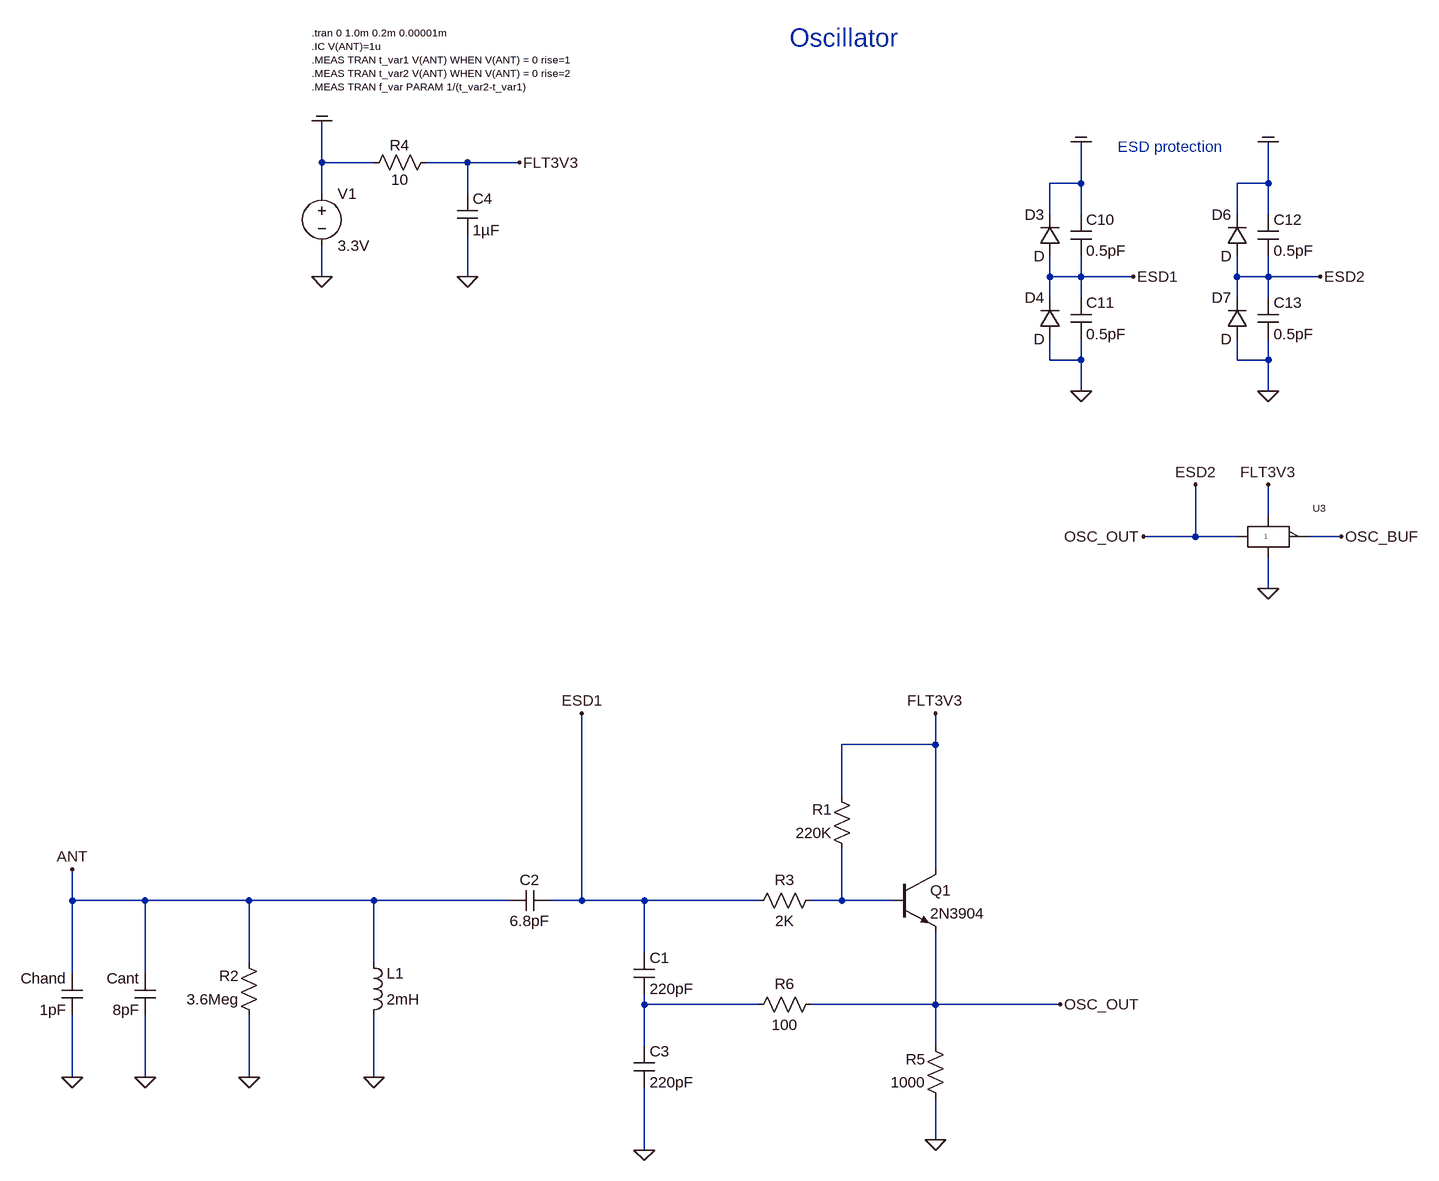
[diagram p0: schematic 2020_npn_osc_v1.asc]
2020_npn_osc_v1.asc, the LTspice schematic file:
Version 4
SHEET 1 2908 1588
WIRE -1056 -336 -1056 -400
WIRE -976 -336 -1056 -336
WIRE -832 -336 -896 -336
WIRE -752 -336 -832 -336
WIRE 112 -304 112 -368
WIRE 112 -304 64 -304
WIRE 400 -304 400 -368
WIRE 400 -304 352 -304
WIRE -1056 -288 -1056 -336
WIRE -832 -288 -832 -336
WIRE 64 -256 64 -304
WIRE 112 -256 112 -304
WIRE 352 -256 352 -304
WIRE 400 -256 400 -304
WIRE -1056 -160 -1056 -208
WIRE -832 -160 -832 -224
WIRE 64 -160 64 -192
WIRE 112 -160 112 -192
WIRE 112 -160 64 -160
WIRE 192 -160 112 -160
WIRE 352 -160 352 -192
WIRE 400 -160 400 -192
WIRE 400 -160 352 -160
WIRE 480 -160 400 -160
WIRE 64 -128 64 -160
WIRE 112 -128 112 -160
WIRE 352 -128 352 -160
WIRE 400 -128 400 -160
WIRE 64 -32 64 -64
WIRE 112 -32 112 -64
WIRE 112 -32 64 -32
WIRE 352 -32 352 -64
WIRE 400 -32 400 -64
WIRE 400 -32 352 -32
WIRE 112 16 112 -32
WIRE 400 16 400 -32
WIRE 400 208 400 160
WIRE 288 240 288 160
WIRE 288 240 208 240
WIRE 352 240 288 240
WIRE 512 240 464 240
WIRE 400 320 400 272
WIRE -112 560 -112 512
WIRE -112 560 -256 560
WIRE -256 640 -256 560
WIRE -112 752 -112 560
WIRE -1440 800 -1440 752
WIRE -1328 800 -1440 800
WIRE -1168 800 -1328 800
WIRE -976 800 -1168 800
WIRE -768 800 -976 800
WIRE -656 800 -656 512
WIRE -656 800 -704 800
WIRE -560 800 -656 800
WIRE -384 800 -560 800
WIRE -256 800 -256 720
WIRE -256 800 -304 800
WIRE -176 800 -256 800
WIRE -560 880 -560 800
WIRE -1168 896 -1168 800
WIRE -976 896 -976 800
WIRE -1440 912 -1440 800
WIRE -1328 912 -1328 800
WIRE -560 960 -560 944
WIRE -384 960 -560 960
WIRE -112 960 -112 848
WIRE -112 960 -304 960
WIRE 80 960 -112 960
WIRE -560 1024 -560 960
WIRE -112 1024 -112 960
WIRE -1440 1072 -1440 976
WIRE -1328 1072 -1328 976
WIRE -1168 1072 -1168 976
WIRE -976 1072 -976 976
WIRE -112 1168 -112 1104
WIRE -560 1184 -560 1088
FLAG -1056 -160 0
FLAG -1440 1072 0
FLAG -1440 752 ANT
FLAG -1056 -400 COM
FLAG 112 16 0
FLAG 112 -368 COM
FLAG 192 -160 ESD1
FLAG 400 16 0
FLAG 400 -368 COM
FLAG 480 -160 ESD2
FLAG -1328 1072 0
FLAG -656 512 ESD1
FLAG 512 240 OSC_BUF
FLAG -832 -160 0
FLAG 288 160 ESD2
FLAG 400 320 0
FLAG -1168 1072 0
FLAG -976 1072 0
FLAG -560 1184 0
FLAG -112 1168 0
FLAG -752 -336 FLT3V3
FLAG 400 160 FLT3V3
FLAG -112 512 FLT3V3
FLAG 80 960 OSC_OUT
FLAG 208 240 OSC_OUT
SYMBOL voltage -1056 -304 R0
WINDOW 123 0 0 Left 2
WINDOW 39 0 0 Left 2
SYMATTR InstName V1
SYMATTR Value 3.3V
SYMBOL ind -992 992 M180
WINDOW 0 36 80 Left 2
WINDOW 3 36 40 Left 2
SYMATTR InstName L1
SYMATTR Value 2mH
SYMATTR SpiceLine Ipk=0.1 Rser=36 Rpar=10Meg Cpar=1.286pF
SYMBOL cap -1424 912 M0
SYMATTR InstName Chand
SYMATTR Value 1pF
SYMBOL diode 80 -192 R180
WINDOW 0 24 64 Left 2
WINDOW 3 24 0 Left 2
SYMATTR InstName D3
SYMBOL diode 80 -64 R180
WINDOW 0 24 64 Left 2
WINDOW 3 24 0 Left 2
SYMATTR InstName D4
SYMBOL cap 96 -256 R0
SYMATTR InstName C10
SYMATTR Value 0.5pF
SYMBOL cap 96 -128 R0
SYMATTR InstName C11
SYMATTR Value 0.5pF
SYMBOL diode 368 -192 R180
WINDOW 0 24 64 Left 2
WINDOW 3 24 0 Left 2
SYMATTR InstName D6
SYMBOL diode 368 -64 R180
WINDOW 0 24 64 Left 2
WINDOW 3 24 0 Left 2
SYMATTR InstName D7
SYMBOL cap 384 -256 R0
SYMATTR InstName C12
SYMATTR Value 0.5pF
SYMBOL cap 384 -128 R0
SYMATTR InstName C13
SYMATTR Value 0.5pF
SYMBOL cap -1312 912 M0
SYMATTR InstName Cant
SYMATTR Value 8pF
SYMBOL res -880 -352 R90
WINDOW 0 5 56 VBottom 2
WINDOW 3 27 56 VTop 2
SYMATTR InstName R4
SYMATTR Value 10
SYMBOL cap -848 -288 R0
SYMATTR InstName C4
SYMATTR Value 1µF
SYMBOL SBORKA\\Logika\\74AHC1G04 400 192 R0
SYMATTR InstName U3
SYMBOL res -240 736 R180
WINDOW 0 31 76 Left 2
WINDOW 3 31 40 Left 2
SYMATTR InstName R1
SYMATTR Value 220K
SYMBOL res -1152 992 R180
WINDOW 0 31 76 Left 2
WINDOW 3 31 40 Left 2
SYMATTR InstName R2
SYMATTR Value 3.6Meg
SYMBOL cap -576 880 R0
SYMATTR InstName C1
SYMATTR Value 220pF
SYMBOL cap -704 784 R90
WINDOW 0 0 32 VBottom 2
WINDOW 3 32 32 VTop 2
SYMATTR InstName C2
SYMATTR Value 6.8pF
SYMBOL cap -576 1024 R0
SYMATTR InstName C3
SYMATTR Value 220pF
SYMBOL npn -176 752 R0
SYMATTR InstName Q1
SYMATTR Value 2N3904
SYMBOL res -400 816 R270
WINDOW 0 32 56 VTop 2
WINDOW 3 0 56 VBottom 2
SYMATTR InstName R3
SYMATTR Value 2K
SYMBOL res -96 1120 R180
WINDOW 0 31 76 Left 2
WINDOW 3 31 40 Left 2
SYMATTR InstName R5
SYMATTR Value 1000
SYMBOL res -400 976 R270
WINDOW 0 32 56 VTop 2
WINDOW 3 0 56 VBottom 2
SYMATTR InstName R6
SYMATTR Value 100
TEXT -1072 -536 Left 1 !.tran 0 1.0m 0.2m 0.00001m\n.IC V(ANT)=1u\n.MEAS TRAN t_var1 V(ANT) WHEN V(ANT) = 0 rise=1\n.MEAS TRAN t_var2 V(ANT) WHEN V(ANT) = 0 rise=2\n.MEAS TRAN f_var PARAM 1/(t_var2-t_var1)
TEXT 168 -360 Left 2 ;ESD protection
TEXT -336 -528 Left 4 ;Oscillator

The netlist it stands for:
* 2020_npn_osc_v1.asc
V1 COM 0 3.3V
L1 0 ANT 2mH Ipk=0.1 Rser=36 Rpar=10Meg Cpar=1.286pF
Chand ANT 0 1pF
D3 ESD1 COM D
D4 0 ESD1 D
C10 COM ESD1 0.5pF
C11 ESD1 0 0.5pF
D6 OSC_OUT COM D
D7 0 OSC_OUT D
C12 COM OSC_OUT 0.5pF
C13 OSC_OUT 0 0.5pF
Cant ANT 0 8pF
R4 FLT3V3 COM 10
C4 FLT3V3 0 1µF
XU3 OSC_OUT OSC_BUF FLT3V3 0 74AHC1G04  ; pins in out vcc gnd
R1 N001 FLT3V3 220K
R2 0 ANT 3.6Meg
C1 ESD1 N002 220pF
C2 ESD1 ANT 6.8pF
C3 N002 0 220pF
Q1 FLT3V3 N001 OSC_OUT 0 2N3904
R3 ESD1 N001 2K
R5 0 OSC_OUT 1000
R6 N002 OSC_OUT 100
.model D D
.lib standard.dio
.model NPN NPN
.model PNP PNP
.lib standard.bjt
.tran 0 1.0m 0.2m 0.00001m
.IC V(ANT)=1u
.MEAS TRAN t_var1 V(ANT) WHEN V(ANT) = 0 rise=1
.MEAS TRAN t_var2 V(ANT) WHEN V(ANT) = 0 rise=2
.MEAS TRAN f_var PARAM 1/(t_var2-t_var1)
* ESD protection
* Oscillator
.lib 74AHC1G04.cir
.backanno
.end